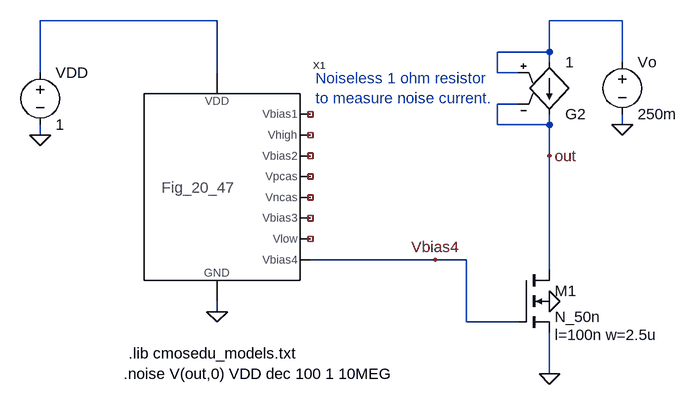
[diagram p0: schematic NOISE_NMOS_Mirror.asc]
NOISE_NMOS_Mirror.asc, the LTspice schematic file:
Version 4
SHEET 1 956 680
WIRE -528 -256 -800 -256
WIRE 96 -256 -16 -256
WIRE -16 -208 -16 -256
WIRE -16 -208 -96 -208
WIRE -16 -192 -16 -208
WIRE 96 -192 96 -256
WIRE -800 -176 -800 -256
WIRE -528 -176 -528 -256
WIRE -96 -176 -96 -208
WIRE -64 -176 -96 -176
WIRE -64 -128 -96 -128
WIRE -96 -96 -96 -128
WIRE -16 -96 -16 -112
WIRE -16 -96 -96 -96
WIRE 96 -96 96 -112
WIRE -800 -80 -800 -96
WIRE -16 -48 -16 -96
WIRE -192 112 -384 112
WIRE -144 112 -192 112
WIRE -16 128 -16 -48
WIRE -528 192 -528 176
WIRE -144 208 -144 112
WIRE -64 208 -144 208
WIRE -16 288 -16 224
FLAG -800 -80 0
FLAG -528 192 0
FLAG -16 288 0
FLAG -192 112 Vbias4
FLAG -16 176 0
FLAG -16 -48 out
FLAG 96 -96 0
SYMBOL Fig_20_47 -528 0 R0
SYMATTR InstName X1
SYMBOL voltage -800 -192 R0
WINDOW 123 0 0 Left 0
WINDOW 39 0 0 Left 0
SYMATTR InstName VDD
SYMATTR Value 1
SYMBOL nmos4 -64 128 R0
WINDOW 123 56 100 Left 0
SYMATTR Value2 l=100n w=2.5u
SYMATTR InstName M1
SYMATTR Value N_50n
SYMBOL g2 -16 -96 M180
SYMATTR InstName G2
SYMATTR Value 1
SYMBOL voltage 96 -208 R0
WINDOW 123 0 0 Left 0
WINDOW 39 0 0 Left 0
SYMATTR InstName Vo
SYMATTR Value 250m
TEXT -672 288 Left 0 !.noise V(out,0) VDD dec 100 1 10MEG
TEXT -664 256 Left 0 !.lib cmosedu_models.txt
TEXT -376 -168 Left 0 ;Noiseless 1 ohm resistor\nto measure noise current.

The netlist it stands for:
* NOISE_NMOS_Mirror.asc
XX1 NC_01 NC_02 NC_03 NC_04 NC_05 NC_06 NC_07 Vbias4 N001 0 Fig_20_47  ; pins Vbias1 Vhigh Vbias2 Vpcas Vncas Vbias3 Vlow Vbias4 VDD GND
VDD N001 0 1
M1 out Vbias4 0 0 N_50n l=100n w=2.5u
G2 N002 out N002 out 1
Vo N002 0 250m
.model NMOS NMOS
.model PMOS PMOS
.lib standard.mos
.noise V(out,0) VDD dec 100 1 10MEG
.lib cmosedu_models.txt
* Noiseless 1 ohm resistor
* to measure noise current.
.backanno
.end